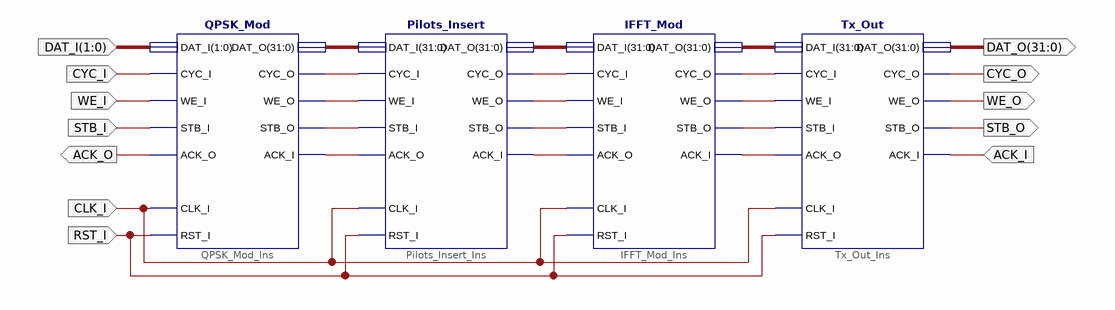
[diagram p0: schematic sheet 1]
// Xilinx ISE schematic OFDM_TX.sch (virtex6) as structural Verilog: 4 symbols, 12 ports
module OFDM_TX (
  input  [1:0] DAT_I,
  input  CYC_I,
  input  WE_I,
  input  STB_I,
  input  CLK_I,
  input  RST_I,
  input  ACK_I,
  output ACK_O,
  output [31:0] DAT_O,
  output CYC_O,
  output WE_O,
  output STB_O
);

  wire XLXN_2, XLXN_3, XLXN_4, XLXN_5, XLXN_7, XLXN_8, XLXN_9, XLXN_10, XLXN_12, XLXN_13, XLXN_14, XLXN_15;
  wire [31:0] XLXN_1, XLXN_6, XLXN_11;

  QPSK_Mod QPSK_Mod_Ins (
    .DAT_I(DAT_I), .CYC_I(CYC_I), .WE_I(WE_I), .STB_I(STB_I), .RST_I(RST_I), .ACK_O(ACK_O), .DAT_O(XLXN_1),
    .CYC_O(XLXN_2), .WE_O(XLXN_3), .STB_O(XLXN_4), .ACK_I(XLXN_5), .CLK_I(CLK_I));
  Pilots_Insert Pilots_Insert_Ins (
    .DAT_I(XLXN_1), .CYC_I(XLXN_2), .WE_I(XLXN_3), .STB_I(XLXN_4), .CLK_I(CLK_I), .RST_I(RST_I),
    .CYC_O(XLXN_7), .STB_O(XLXN_9), .WE_O(XLXN_8), .DAT_O(XLXN_6), .ACK_I(XLXN_10), .ACK_O(XLXN_5));
  IFFT_Mod IFFT_Mod_Ins (
    .DAT_I(XLXN_6), .CYC_I(XLXN_7), .WE_I(XLXN_8), .STB_I(XLXN_9), .CYC_O(XLXN_12), .STB_O(XLXN_14),
    .WE_O(XLXN_13), .ACK_I(XLXN_15), .ACK_O(XLXN_10), .DAT_O(XLXN_11), .CLK_I(CLK_I), .RST_I(RST_I));
  Tx_Out Tx_Out_Ins (
    .DAT_I(XLXN_11), .WE_I(XLXN_13), .STB_I(XLXN_14), .CYC_I(XLXN_12), .CLK_I(CLK_I), .RST_I(RST_I),
    .CYC_O(CYC_O), .STB_O(STB_O), .WE_O(WE_O), .ACK_I(ACK_I), .ACK_O(XLXN_15), .DAT_O(DAT_O));
endmodule
